# Altium schematic sheet Mainboard_User LED3 Connector.SchDoc
size A4
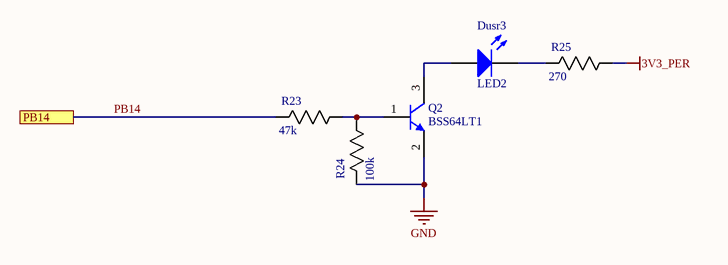
[diagram p0: Mainboard_User LED3 Connector.SchDoc]

## Parts
Dusr3  LED2  [3.2X1.6X1.1]
Q2  BSS64LT1  [ONSC-SOT-23-3-318-08_V]
R23  47k  [0805]
R24  100k  [0805]
R25  270  [0805]

## Ports
PB14

## Nets
3V3_PER: R25.1(R1)
GND: Q2.2(E) R24.2(R2)
PB14: R23.2(R2) ; port PB14
NetDusr3_1: Dusr3.1(A) Q2.3(C)
NetDusr3_2: Dusr3.2(K) R25.2(R2)
NetQ2_1: Q2.1(B) R23.1(R1) R24.1(R1)

## Library data of the parts
Dusr3 = LED RED SMD: Typical RED, GREEN, YELLOW, AMBER GaAs LED; Lens Color: Colorless; Voltage - Forward (Vf) (Typ): 1.7V; Current - Test: 20mA; Lens Transparency: Clear; Package: 1206; Color: Red
Q2 = CMP-1048-00605-1: Driver Transistor, NPN Silicon, 3-Pin SOT-23, Tape and Reel; Manufacturer: On Semiconductor; IC Continuous (A): 0.1; fT Min (MHz): 60; ComponentLink1Description: Manufacturer URL; ComponentLink3Description: Package Specification; ComponentLink2URL: http://www.onsemi.com/pub_link/Collateral/BSS64LT1-D.PDF; ComponentLink1URL: http://www.onsemi.com/; ComponentLink2Description: Datasheet; ComponentLink3URL: http://www.onsemi.cn/pub_link/Collateral/318-08.PDF; RoHS: FALSE; PackageVersion: Rev. AP, 11/2009; Polarity: NPN; PartNumber: BSS64LT1; Mounting Technology: Surface Mount; PackageDescription: 3-Pin Small Outline Transistor, Body 2.92 x 1.3 mm, Pitch 0.95 mm; Packing: Tape and Reel; DatasheetVersion: Rev. 5; PackageReference: SOT-23-3-318-08
R23 = RES 47k 1/8W - 1%: RES SMD 47K OHM 1% 1/8W 0805; Power (Watts): 0.125W; Package: 0805; Value: 47k; Tolerance: 1%
R24 = RES 100k 1/8W - 1%: RES SMD 100K OHM 1% 1/8W 0805; Power (Watts): 0.125W; Package: 0805; Value: 100k; Tolerance: 1%
R25 = RES 270.0 1/8W: RES SMD 270 OHM 5% 1/8W 0805; Power (Watts): 0.125W; Package: 0805; Value: 270; Tolerance: 5%